# Altium schematic sheet 5_2_switches.SchDoc: RF Switches
size A4; OrganizationName: Pluton UPV; Address1: Universitat Politècnica; Address2: de València (UPV); Address3: Camí de Vera, València; Address4: Spain; SheetNumber: 8; SheetTotal: 12
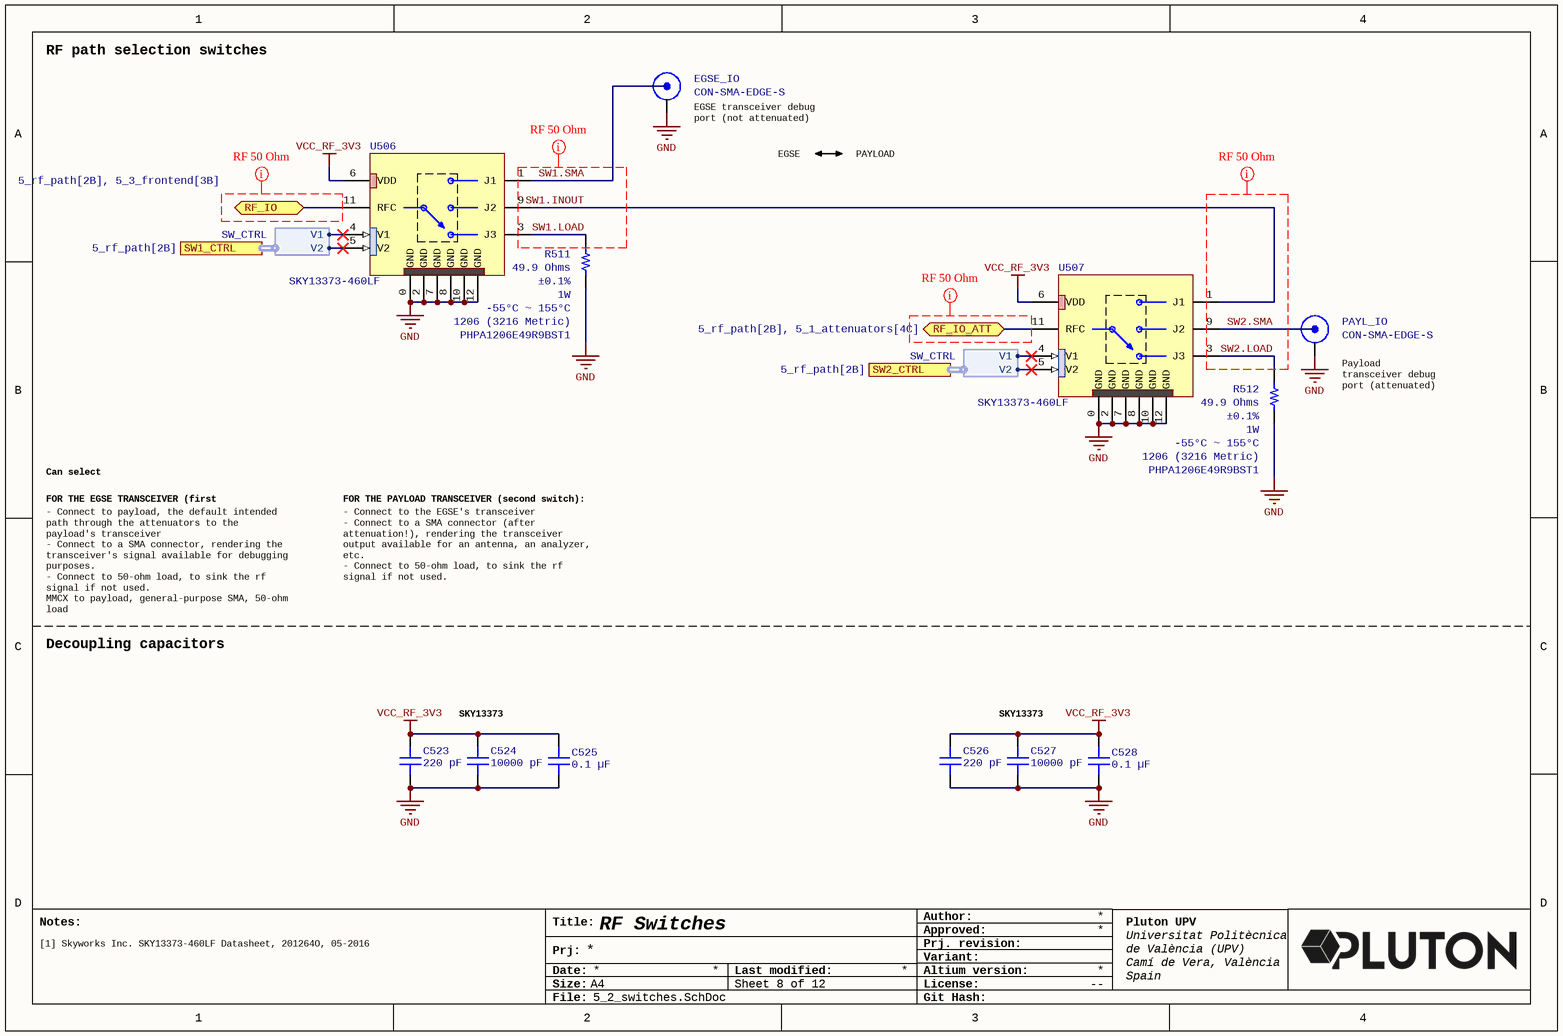
[diagram p0: 5_2_switches.SchDoc]

## Parts
C523  220 pF  [CAP 0201_0603]
C524  10000 pF  [CAP 0402_1005]
C525  0.1 µF  [CAP 0402_1005]
C526  220 pF  [CAP 0201_0603]
C527  10000 pF  [CAP 0402_1005]
C528  0.1 µF  [CAP 0402_1005]
EGSE_IO  CON-SMA-EDGE-S  [CON-SMA-EDGE-S]
PAYL_IO  CON-SMA-EDGE-S  [CON-SMA-EDGE-S]
R511  49.9 Ohms  Part Number: PHPA1206E49R9BST1  Device Package: 1206 (3216 Metric)  Operating Temperature: -55°C ~ 155°C  Power (Watts): 1W  Tolerance: ±0.1%  [RES 1206_3216]
R512  49.9 Ohms  Part Number: PHPA1206E49R9BST1  Device Package: 1206 (3216 Metric)  Operating Temperature: -55°C ~ 155°C  Power (Watts): 1W  Tolerance: ±0.1%  [RES 1206_3216]
U506  SKY13373-460LF  [SKY13373-460LF]
U507  SKY13373-460LF  [SKY13373-460LF]

## Ports
RF_IO (bidir, see 5_rf_path[2B], 5_3_frontend[3B]), RF_IO_ATT (bidir, see 5_rf_path[2B], 5_1_attenuators[4C]), SW1_CTRL (harness SW_CTRL, see 5_rf_path[2B]), SW2_CTRL (harness SW_CTRL, see 5_rf_path[2B])

## Harnesses
SW_CTRL: V1, V2

## Nets
GND: C523.1 C524.1 C525.1 C526.1 C527.1 C528.1 EGSE_IO.2(GND) PAYL_IO.2(GND) R511.1 R512.1 U506.0(GND) U506.2(GND) U506.7(GND) U506.8(GND) U506.10(GND) U506.12(GND) U507.0(GND) U507.2(GND) U507.7(GND) U507.8(GND) U507.10(GND) U507.12(GND)
VCC_RF_3V3: C523.2 C524.2 C525.2 C526.2 C527.2 C528.2 U506.6(VDD) U507.6(VDD)
RF_IO: U506.11(RFC) ; port RF_IO
RF_IO_ATT: U507.11(RFC) ; port RF_IO_ATT
SW1.INOUT: U506.9(J2) U507.1(J1)
SW1.LOAD: R511.2 U506.3(J3)
SW1.SMA: EGSE_IO.1(SIGNAL) U506.1(J1)
SW2.LOAD: R512.2 U507.3(J3)
SW2.SMA: PAYL_IO.1(SIGNAL) U507.9(J2)
NetU506_4: U506.4(V1) ; port SW1_CTRL.V1
NetU506_5: U506.5(V2) ; port SW1_CTRL.V2
NetU507_4: U507.4(V1) ; port SW2_CTRL.V1
NetU507_5: U507.5(V2) ; port SW2_CTRL.V2

## Layout directives
net class RF50; rule Width Constraint [Pref Impedance = 50.00ohms    Min Impedance = 50.00ohms    Max Impedance = 50.00ohms]: (no net found under the mark), SW1.INOUT, SW1.LOAD, SW1.SMA, SW2.LOAD, SW2.SMA

## Notes on the sheet
- RF path selection switches
- (near EGSE_IO) EGSE transceiver debug port (not attenuated)
- EGSE
- PAYLOAD
- (near PAYL_IO) Payload transceiver debug port (attenuated)
- Can select between:
- FOR THE EGSE TRANSCEIVER (first switch):
- FOR THE PAYLOAD TRANSCEIVER (second switch):
- Decoupling capacitors
- - Connect to payload, the default intended path through the attenuators to the payload's transceiver
  - Connect to a SMA connector, rendering the transceiver's signal available for debugging purposes.
  - Connect to 50-ohm load, to sink the rf signal if not used.
  MMCX to payload, general-purpose SMA, 50-ohm load
- - Connect to the EGSE's transceiver
  - Connect to a SMA connector (after attenuation!), rendering the transceiver output available for an antenna, an analyzer, etc.
  - Connect to 50-ohm load, to sink the rf signal if not used.
- (near C524) SKY13373
- (near C527) SKY13373
- [1] Skyworks Inc. SKY13373-460LF Datasheet, 201264O, 05-2016
- Notes:
- Title:
- Author:
- Approved:
- Date:
- Prj:
- Size:
- A4
- Last modified:
- Altium version:
- Variant:
- Prj. revision:
- License:
- --
- File:
- Git Hash:

## Library data of the parts
C523 C526 = GRM0335C1H221JA01D: CAP CER 220PF 50V C0G/NP0 0201; manufacturer: Murata Electronics; Temperature Coefficient: C0G, NP0; Tolerance: ±5%; Part Number: GRM0335C1H221JA01D; Value: 220 pF; Applications: General Purpose; Capacitance: 220 pF; componentlink1description: Datasheet; componentlink1url: https://search.murata.co.jp/Ceramy/image/img/A01X/G101/ENG/GRM0335C1H221JA01-01.pdf; componentlink2description: DigiKey Link; componentlink2url: https://www.digikey.com/en/products/detail/murata-electronics/GRM0335C1H221JA01D/4904370; Device Package: 0201 (0603 Metric); lastupdated: 04/06/2024 19:01:09; Lifecycle Status: Active; Minimum Order: 1; Mounting Type: Surface Mount; Operating Temperature: -55°C ~ 125°C; Package / Case: 0201 (0603 Metric); packaging: CutTape; partid: 574; Part Status: Active; price: 0.01; series: GRM; Size / Dimension: 0.024" L x 0.012" W (0.60mm x 0.30mm); Supplier 1: DigiKey; Supplier Part Number 1: 490-11316-1-ND; Thickness (Max): 0.013" (0.33mm); Voltage - Rated: 50V
C524 C527 = GRM1555C1E103JE01J: CAP CER 10000PF 25V C0G/NP0 0402; manufacturer: Murata Electronics; Temperature Coefficient: C0G, NP0; Tolerance: ±5%; Part Number: GRM1555C1E103JE01J; Value: 10000 pF; Applications: General Purpose; Capacitance: 10000 pF; componentlink1description: Datasheet; componentlink1url: https://search.murata.co.jp/Ceramy/image/img/A01X/G101/ENG/GRM1555C1E103JE01-01A.pdf; componentlink2description: DigiKey Link; componentlink2url: https://www.digikey.com/en/products/detail/murata-electronics/GRM1555C1E103JE01J/16033801; Device Package: 0402 (1005 Metric); lastupdated: 09/02/2024 20:04:09; Lifecycle Status: Active; Minimum Order: 1; Mounting Type: Surface Mount, MLCC; Operating Temperature: -55°C ~ 125°C; Package / Case: 0402 (1005 Metric); packaging: TapeAndReel; partid: 41084; Part Status: Active; price: 0.02; series: GRM; Size / Dimension: 0.039" L x 0.020" W (1.00mm x 0.50mm); Supplier 1: DigiKey; Supplier Part Number 1: 490-GRM1555C1E103JE01JCT-ND; Thickness (Max): 0.026" (0.65mm); Voltage - Rated: 25V
C525 C528 = C0402C104K4RECAUTO: CAP CER 0402 0.1UF 16V X7R 10%; manufacturer: KEMET; Part Number: C0402C104K4RECAUTO; Value: 0.1 µF; Applications: Automotive, ESD Protection; Capacitance: 0.1 µF; componentlink1description: Datasheet; componentlink1url: https://api.kemet.com/component-edge/download/datasheet/C0402C104K4RECAUTO.pdf; componentlink2description: DigiKey Link; componentlink2url: https://www.digikey.com/en/products/detail/kemet/C0402C104K4RECAUTO/8563695; Device Package: 0402 (1005 Metric); lastupdated: 09/02/2024 20:04:38; Lifecycle Status: Active; Minimum Order: 1; Mounting Type: Surface Mount, MLCC; Operating Temperature: -55°C ~ 125°C; Package / Case: 0402 (1005 Metric); packaging: TapeAndReel; partid: 1731; Part Status: Active; price: 0.01; Ratings: AEC-Q200; series: ESD SMD Auto X7R; Size / Dimension: 0.039" L x 0.020" W (1.00mm x 0.50mm); Supplier 1: DigiKey; Supplier Part Number 1: 399-17167-1-ND; Temperature Coefficient: X7R; Thickness (Max): 0.022" (0.55mm); Tolerance: ±10%; Voltage - Rated: 16V
R511 R512 = PHPA1206E49R9BST1: THIN FILM RES SMD 49.9 OHM 0.1%; Manufacturer: Vishay Dale Thin Film; Temperature Coefficient: ±25ppm/°C; ComponentLink1Description: Datasheet; ComponentLink1URL: https://www.vishay.com/docs/60160/phpa.pdf; ComponentLink2Description: DigiKey Link; ComponentLink2URL: https://www.digikey.com/en/products/detail/vishay-dale-thin-film/PHPA1206E49R9BST1/14555186; Composition: Thin Film; Features: Anti-Sulfur, Automotive AEC-Q200, High Power, Moisture Resistant; Height - Seated (Max): 0.020" (0.51mm); LastUpdated: 09/02/2024 20:53:25; Lifecycle Status: Active; Minimum Order: 1; Number of Terminations: 2; Package / Case: 1206 (3216 Metric); Packaging: TapeAndReel; PartId: 58771; Part Status: Active; Price: 0.76; Ratings: AEC-Q200; Resistance: 49.9 Ohms; Series: PHPA; Size / Dimension: 0.126" L x 0.063" W (3.20mm x 1.60mm); Supplier 1: DigiKey; Supplier Part Number 1: 764-PHPA1206E49R9BST1CT-ND; Supplier Device Package: 1206; Value: 49.9 Ohms
U506 U507 = SKY13373-460LF: 0.1 to 8.0 GHz SP3T Switch